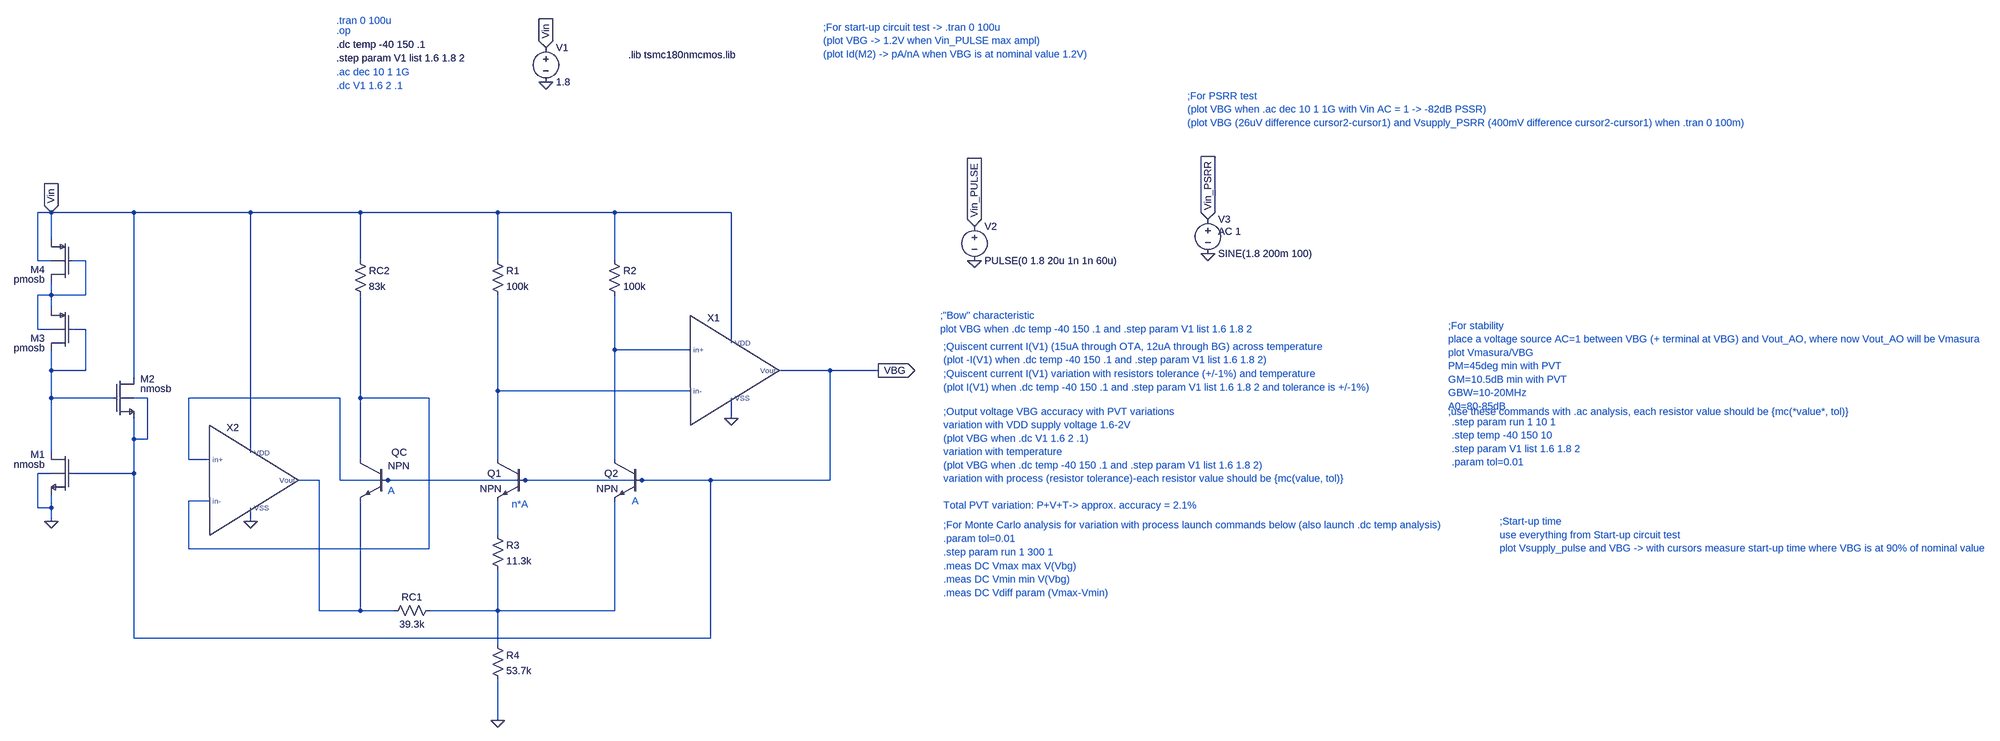
[diagram p0: schematic Brokaw_Bandgap.asc]
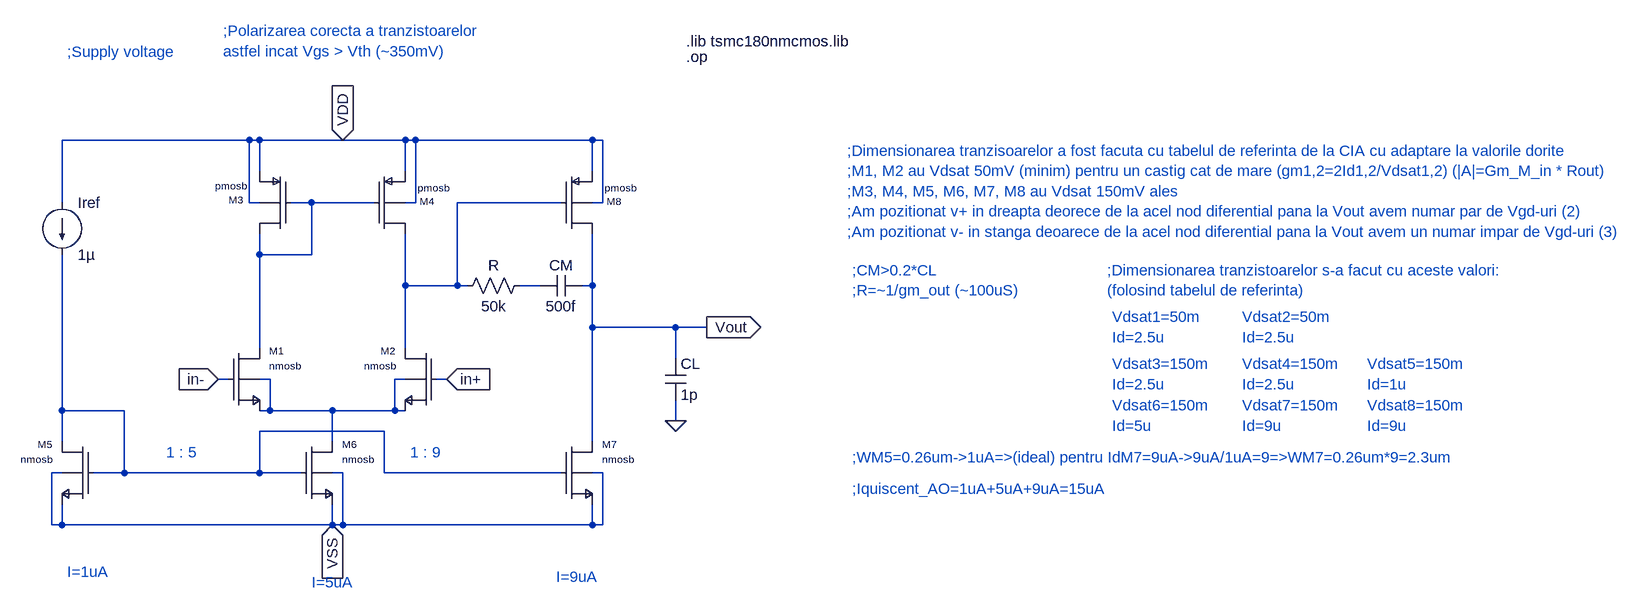
[diagram p1: sub-circuit ao_miller.asc]
Brokaw_Bandgap.asc, the LTspice schematic file:
Version 4
SHEET 1 3360 1700
WIRE -1312 -288 -1344 -288
WIRE -1120 -288 -1312 -288
WIRE -848 -288 -1120 -288
WIRE -592 -288 -848 -288
WIRE -272 -288 -592 -288
WIRE 0 -288 -272 -288
WIRE 272 -288 0 -288
WIRE -1312 -224 -1312 -288
WIRE -1344 -176 -1344 -288
WIRE -1312 -176 -1344 -176
WIRE -1232 -176 -1264 -176
WIRE -592 -176 -592 -288
WIRE -272 -176 -272 -288
WIRE 0 -176 0 -288
WIRE -1312 -96 -1312 -128
WIRE -1312 -96 -1344 -96
WIRE -1232 -96 -1232 -176
WIRE -1232 -96 -1312 -96
WIRE -1312 -64 -1312 -96
WIRE -1344 -16 -1344 -96
WIRE -1312 -16 -1344 -16
WIRE -1232 -16 -1264 -16
WIRE 272 16 272 -288
WIRE 0 32 0 -96
WIRE 176 32 0 32
WIRE -1312 80 -1312 32
WIRE -1232 80 -1232 -16
WIRE -1232 80 -1312 80
WIRE 544 80 384 80
WIRE 656 80 544 80
WIRE -1120 96 -1120 -288
WIRE -272 128 -272 -96
WIRE 176 128 -272 128
WIRE -1312 144 -1312 80
WIRE -1168 144 -1312 144
WIRE -1088 144 -1120 144
WIRE -640 144 -992 144
WIRE -592 144 -592 -96
WIRE -432 144 -592 144
WIRE 272 192 272 144
WIRE -1120 240 -1120 192
WIRE -1088 240 -1088 144
WIRE -1088 240 -1120 240
WIRE -1312 272 -1312 144
WIRE -848 272 -848 -288
WIRE -992 288 -992 144
WIRE -944 288 -992 288
WIRE -592 288 -592 144
WIRE -272 288 -272 128
WIRE 0 288 0 32
WIRE -1312 320 -1344 320
WIRE -1120 320 -1120 240
WIRE -1120 320 -1264 320
WIRE -688 336 -736 336
WIRE -640 336 -640 144
WIRE -528 336 -640 336
WIRE -208 336 -528 336
WIRE 64 336 -208 336
WIRE 224 336 64 336
WIRE 544 336 544 80
WIRE 544 336 224 336
WIRE -944 384 -992 384
WIRE -1344 400 -1344 320
WIRE -1312 400 -1312 368
WIRE -1312 400 -1344 400
WIRE -1312 432 -1312 400
WIRE -848 432 -848 400
WIRE -272 464 -272 384
WIRE -992 496 -992 384
WIRE -432 496 -432 144
WIRE -432 496 -992 496
WIRE -688 640 -688 336
WIRE -592 640 -592 384
WIRE -592 640 -688 640
WIRE -512 640 -592 640
WIRE -272 640 -272 544
WIRE -272 640 -432 640
WIRE 0 640 0 384
WIRE 0 640 -272 640
WIRE -1120 704 -1120 320
WIRE 224 704 224 336
WIRE 224 704 -1120 704
WIRE -272 720 -272 640
WIRE -272 896 -272 800
FLAG -160 -592 0
FLAG -160 -672 Vin
IOPIN -160 -672 In
FLAG 656 80 VBG
IOPIN 656 80 Out
FLAG 272 192 0
FLAG -1312 432 0
FLAG 880 -176 0
FLAG 880 -256 Vin_PULSE
IOPIN 880 -256 In
FLAG 1424 -192 0
FLAG 1424 -272 Vin_PSRR
IOPIN 1424 -272 In
FLAG -272 896 0
FLAG -848 432 0
FLAG -1312 -288 Vin
IOPIN -1312 -288 In
SYMBOL AO_Miller 288 48 R0
WINDOW 0 -57 -75 Bottom 2
SYMATTR InstName X1
SYMBOL voltage -160 -688 R0
WINDOW 123 24 44 Left 2
WINDOW 39 0 0 Left 0
SYMATTR InstName V1
SYMATTR Value 1.8
SYMBOL res -288 -192 R0
SYMATTR InstName R1
SYMATTR Value 100k
SYMATTR SpiceLine tol=0
SYMBOL res -16 -192 R0
SYMATTR InstName R2
SYMATTR Value 100k
SYMATTR SpiceLine tol=0
SYMBOL res -288 448 R0
SYMATTR InstName R3
SYMATTR Value 11.3k
SYMATTR SpiceLine tol=0
SYMBOL npn -208 288 M0
SYMATTR InstName Q1
SYMATTR SpiceLine AREA=8
SYMBOL npn 64 288 M0
SYMATTR InstName Q2
SYMATTR SpiceLine AREA=1
SYMBOL pmosb -1264 -224 M0
WINDOW 0 63 69 Left 2
WINDOW 3 63 92 Left 2
SYMATTR InstName M4
SYMATTR Value2 l=100u w=0.88u
SYMBOL pmosb -1264 -64 M0
WINDOW 0 63 69 Left 2
WINDOW 3 63 92 Left 2
SYMATTR InstName M3
SYMATTR Value2 l=100u w=0.88u
SYMBOL nmosb -1168 96 R0
WINDOW 0 63 4 Left 2
WINDOW 3 63 27 Left 2
SYMATTR InstName M2
SYMATTR Value2 l=10u w=3.84u
SYMBOL nmosb -1264 272 M0
WINDOW 0 63 4 Left 2
WINDOW 3 63 27 Left 2
SYMATTR InstName M1
SYMATTR Value2 l=5u w=0.5u
SYMBOL voltage 880 -272 R0
WINDOW 123 0 0 Left 0
WINDOW 39 0 0 Left 0
SYMATTR InstName V2
SYMATTR Value PULSE(0 1.8 20u 1n 1n 60u)
SYMBOL voltage 1424 -288 R0
WINDOW 123 24 44 Left 2
WINDOW 39 0 0 Left 0
SYMATTR Value2 AC 1
SYMATTR InstName V3
SYMATTR Value SINE(1.8 200m 100)
SYMBOL res -288 704 R0
SYMATTR InstName R4
SYMATTR Value 53.7k
SYMBOL res -608 -192 R0
SYMATTR InstName RC2
SYMATTR Value 83k
SYMBOL npn -528 288 M0
WINDOW 0 -44 -17 Left 2
WINDOW 3 -50 15 Left 2
SYMATTR InstName QC
SYMATTR SpiceLine AREA=1
SYMBOL res -416 624 R90
WINDOW 0 0 56 VBottom 2
WINDOW 3 32 56 VTop 2
SYMATTR InstName RC1
SYMATTR Value 39.3k
SYMBOL AO_Miller -832 304 R0
WINDOW 0 -57 -75 Bottom 2
SYMATTR InstName X2
TEXT -240 392 Left 2 ;n*A
TEXT 40 384 Left 2 ;A
TEXT -648 -712 Left 2 ;.op
TEXT -648 -680 Left 2 !.dc temp -40 150 .1
TEXT 32 -656 Left 2 !.lib tsmc180nmcmos.lib
TEXT -648 -736 Left 2 ;.tran 0 100u
TEXT 528 -720 Left 2 ;;For start-up circuit test -> .tran 0 100u\n(plot VBG -> 1.2V when Vin_PULSE max ampl)\n(plot Id(M2) -> pA/nA when VBG is at nominal value 1.2V)
TEXT -648 -648 Left 2 !.step param V1 list 1.6 1.8 2
TEXT -648 -616 Left 2 ;.ac dec 10 1 1G
TEXT 1376 -560 Left 2 ;;For PSRR test\n(plot VBG when .ac dec 10 1 1G with Vin AC = 1 -> -82dB PSSR)\n(plot VBG (26uV difference cursor2-cursor1) and Vsupply_PSRR (400mV difference cursor2-cursor1) when .tran 0 100m)
TEXT 808 24 Left 2 ;;Quiscent current I(V1) (15uA through OTA, 12uA through BG) across temperature\n(plot -I(V1) when .dc temp -40 150 .1 and .step param V1 list 1.6 1.8 2)
TEXT -648 -584 Left 2 ;.dc V1 1.6 2 .1
TEXT 808 88 Left 2 ;;Quiscent current I(V1) variation with resistors tolerance (+/-1%) and temperature\n(plot I(V1) when .dc temp -40 150 .1 and .step param V1 list 1.6 1.8 2 and tolerance is +/-1%)
TEXT 808 176 Left 2 ;;Output voltage VBG accuracy with PVT variations\nvariation with VDD supply voltage 1.6-2V\n(plot VBG when .dc V1 1.6 2 .1)\nvariation with temperature\n(plot VBG when .dc temp -40 150 .1 and .step param V1 list 1.6 1.8 2)\nvariation with process (resistor tolerance)-each resistor value should be {mc(value, tol)}\n \nTotal PVT variation: P+V+T-> approx. accuracy = 2.1%
TEXT 808 472 Left 2 ;.param tol=0.01\n.step param run 1 300 1
TEXT 808 536 Left 2 ;.meas DC Vmax max V(Vbg)\n.meas DC Vmin min V(Vbg)\n.meas DC Vdiff param (Vmax-Vmin)
TEXT 808 440 Left 2 ;;For Monte Carlo analysis for variation with process launch commands below (also launch .dc temp analysis)
TEXT 800 -48 Left 2 ;;"Bow" characteristic\nplot VBG when .dc temp -40 150 .1 and .step param V1 list 1.6 1.8 2
TEXT 1984 -24 Left 2 ;;For stability\nplace a voltage source AC=1 between VBG (+ terminal at VBG) and Vout_AO, where now Vout_AO will be Vmasura\nplot Vmasura/VBG\nPM=45deg min with PVT\nGM=10.5dB min with PVT\nGBW=10-20MHz\nA0=80-85dB
TEXT 2104 432 Left 2 ;;Start-up time\nuse everything from Start-up circuit test\nplot Vsupply_pulse and VBG -> with cursors measure start-up time where VBG is at 90% of nominal value
TEXT 1992 200 Left 2 ;.step param run 1 10 1\n.step temp -40 150 10\n.step param V1 list 1.6 1.8 2\n.param tol=0.01
TEXT 1984 176 Left 2 ;;use these commands with .ac analysis, each resistor value should be {mc(*value*, tol)}
TEXT -528 360 Left 2 ;A

ao_miller.asc, the sub-circuit schematic file:
Version 4
SHEET 1 2312 680
WIRE 80 -304 -208 -304
WIRE 96 -304 80 -304
WIRE 224 -304 96 -304
WIRE 320 -304 224 -304
WIRE 336 -304 320 -304
WIRE 608 -304 336 -304
WIRE 624 -304 608 -304
WIRE 96 -256 96 -304
WIRE 320 -256 320 -304
WIRE 608 -256 608 -304
WIRE -208 -208 -208 -304
WIRE 80 -208 80 -304
WIRE 96 -208 80 -208
WIRE 176 -208 144 -208
WIRE 272 -208 176 -208
WIRE 336 -208 336 -304
WIRE 336 -208 320 -208
WIRE 560 -208 400 -208
WIRE 624 -208 624 -304
WIRE 624 -208 608 -208
WIRE 96 -128 96 -160
WIRE 176 -128 176 -208
WIRE 176 -128 96 -128
WIRE 320 -80 320 -160
WIRE 400 -80 400 -208
WIRE 400 -80 320 -80
WIRE 416 -80 400 -80
WIRE 528 -80 496 -80
WIRE 608 -80 608 -160
WIRE 608 -80 592 -80
WIRE 608 -16 608 -80
WIRE 736 -16 608 -16
WIRE 784 -16 736 -16
WIRE 96 16 96 -128
WIRE 320 16 320 -80
WIRE 736 32 736 -16
WIRE 48 64 32 64
WIRE 112 64 96 64
WIRE 320 64 304 64
WIRE 384 64 368 64
WIRE -208 112 -208 -128
WIRE -112 112 -208 112
WIRE 112 112 112 64
WIRE 112 112 96 112
WIRE 208 112 112 112
WIRE 304 112 304 64
WIRE 304 112 208 112
WIRE 320 112 304 112
WIRE 736 128 736 96
WIRE 288 144 96 144
WIRE -208 160 -208 112
WIRE 208 160 208 112
WIRE 608 160 608 -16
WIRE -208 208 -224 208
WIRE -112 208 -112 112
WIRE -112 208 -160 208
WIRE 96 208 96 144
WIRE 96 208 -112 208
WIRE 160 208 96 208
WIRE 224 208 208 208
WIRE 288 208 288 144
WIRE 560 208 288 208
WIRE 624 208 608 208
WIRE -224 288 -224 208
WIRE -208 288 -208 256
WIRE -208 288 -224 288
WIRE 208 288 208 256
WIRE 208 288 -208 288
WIRE 224 288 224 208
WIRE 224 288 208 288
WIRE 608 288 608 256
WIRE 608 288 224 288
WIRE 624 288 624 208
WIRE 624 288 608 288
FLAG 384 64 in+
IOPIN 384 64 In
FLAG 32 64 in-
IOPIN 32 64 In
FLAG 224 -304 VDD
IOPIN 224 -304 In
FLAG 784 -16 Vout
IOPIN 784 -16 Out
FLAG 208 288 VSS
IOPIN 208 288 In
FLAG 736 128 0
SYMBOL nmosb 48 16 R0
WINDOW 0 63 4 Left 1
WINDOW 3 63 27 Left 1
SYMATTR InstName M1
SYMATTR Value2 l=1u w=5.76u
SYMBOL nmosb 368 16 M0
WINDOW 0 63 4 Left 1
WINDOW 3 63 27 Left 1
SYMATTR InstName M2
SYMATTR Value2 l=1u w=5.76u
SYMBOL current -208 -208 R0
WINDOW 123 0 0 Left 0
WINDOW 39 0 0 Left 0
SYMATTR InstName Iref
SYMATTR Value 1µ
SYMBOL nmosb 160 160 R0
WINDOW 0 63 4 Left 1
WINDOW 3 63 27 Left 1
SYMATTR InstName M6
SYMATTR Value2 l=1u w=1.3u
SYMBOL nmosb -160 160 M0
WINDOW 0 63 4 Left 1
WINDOW 3 63 27 Left 1
SYMATTR InstName M5
SYMATTR Value2 l=1u w=0.26u
SYMBOL pmosb 144 -256 M0
WINDOW 0 73 44 Left 1
WINDOW 3 68 22 Left 1
SYMATTR InstName M3
SYMATTR Value2 l=1u w=2.19u
SYMBOL pmosb 272 -256 R0
WINDOW 0 70 46 Left 1
WINDOW 3 67 25 Left 1
SYMATTR InstName M4
SYMATTR Value2 l=1u w=2.19u
SYMBOL pmosb 560 -256 R0
WINDOW 0 70 46 Left 1
WINDOW 3 67 25 Left 1
SYMATTR InstName M8
SYMATTR Value2 l=1u w=7.89u
SYMBOL nmosb 560 160 R0
WINDOW 0 63 4 Left 1
WINDOW 3 63 27 Left 1
SYMATTR InstName M7
SYMATTR Value2 l=1u w=2.3u
SYMBOL cap 720 32 R0
SYMATTR InstName CL
SYMATTR Value 1p
SYMBOL res 512 -96 R90
WINDOW 0 0 56 VBottom 2
WINDOW 3 32 56 VTop 2
SYMATTR InstName R
SYMATTR Value 50k
SYMBOL cap 592 -96 R90
WINDOW 0 0 32 VBottom 2
WINDOW 3 32 32 VTop 2
SYMATTR InstName CM
SYMATTR Value 500f
TEXT 752 -456 Left 2 !.lib tsmc180nmcmos.lib
TEXT -48 176 Left 2 ;1 : 5
TEXT 1008 184 Left 2 ;;WM5=0.26um->1uA=>(ideal) pentru IdM7=9uA->9uA/1uA=9=>WM7=0.26um*9=2.3um
TEXT 1800 40 Left 2 ;Vdsat5=150m\nId=1u
TEXT -200 360 Left 2 ;I=1uA
TEXT 176 376 Left 2 ;I=5uA
TEXT 552 368 Left 2 ;I=9uA
TEXT 1008 232 Left 2 ;;Iquiscent_AO=1uA+5uA+9uA=15uA
TEXT 328 176 Left 2 ;1 : 9
TEXT 40 -472 Left 2 ;;Polarizarea corecta a tranzistoarelor\nastfel incat Vgs > Vth (~350mV)
TEXT 1408 -32 Left 2 ;Vdsat1=50m\nId=2.5u
TEXT 1608 -32 Left 2 ;Vdsat2=50m\nId=2.5u
TEXT 1408 40 Left 2 ;Vdsat3=150m\nId=2.5u
TEXT 1608 40 Left 2 ;Vdsat4=150m\nId=2.5u
TEXT 1800 104 Left 2 ;Vdsat8=150m\nId=9u
TEXT 1608 104 Left 2 ;Vdsat7=150m\nId=9u
TEXT 1408 104 Left 2 ;Vdsat6=150m\nId=5u
TEXT 1000 -288 Left 2 ;;Dimensionarea tranzisoarelor a fost facuta cu tabelul de referinta de la CIA cu adaptare la valorile dorite\n;M1, M2 au Vdsat 50mV (minim) pentru un castig cat de mare (gm1,2=2Id1,2/Vdsat1,2) (|A|=Gm_M_in * Rout)\n;M3, M4, M5, M6, M7, M8 au Vdsat 150mV ales\n;Am pozitionat v+ in dreapta deorece de la acel nod diferential pana la Vout avem numar par de Vgd-uri (2)\n;Am pozitionat v- in stanga deoarece de la acel nod diferential pana la Vout avem un numar impar de Vgd-uri (3)
TEXT -200 -440 Left 2 ;;Supply voltage
TEXT 1400 -104 Left 2 ;;Dimensionarea tranzistoarelor s-a facut cu aceste valori:\n(folosind tabelul de referinta)
TEXT 752 -432 Left 2 !.op
TEXT 1008 -104 Left 2 ;;CM>0.2*CL\n;R=~1/gm_out (~100uS)

The netlist it stands for:
* Brokaw_Bandgap.asc
XX1 N003 N004 Vin 0 VBG ao_miller
V1 Vin 0 1.8
R1 Vin N004 100k tol=0
R2 Vin N003 100k tol=0
R3 N007 N008 11.3k tol=0
Q1 N004 VBG N007 0 NPN AREA=8
Q2 N003 VBG N008 0 NPN AREA=1
M4 N001 N001 Vin Vin pmosb l=100u w=0.88u
M3 N002 N002 N001 N001 pmosb l=100u w=0.88u
M2 Vin N002 VBG VBG nmosb l=10u w=3.84u
M1 N002 VBG 0 0 nmosb l=5u w=0.5u
V2 Vin_PULSE 0 PULSE(0 1.8 20u 1n 1n 60u)
V3 Vin_PSRR 0 SINE(1.8 200m 100) AC 1
R4 N008 0 53.7k
RC2 Vin N005 83k
QC N005 VBG N006 0 NPN AREA=1
RC1 N008 N006 39.3k
XX2 VBG N005 Vin 0 N006 ao_miller

* block symbol definitions
.subckt ao_miller in+ in- VDD VSS Vout
M1 N001 in- N004 N004 nmosb l=1u w=5.76u
M2 N002 in+ N004 N004 nmosb l=1u w=5.76u
Iref VDD N005 1µ
M6 N004 N005 VSS VSS nmosb l=1u w=1.3u
M5 N005 N005 VSS VSS nmosb l=1u w=0.26u
M3 N001 N001 VDD VDD pmosb l=1u w=2.19u
M4 N002 N001 VDD VDD pmosb l=1u w=2.19u
M8 Vout N002 VDD VDD pmosb l=1u w=7.89u
M7 Vout N005 VSS VSS nmosb l=1u w=2.3u
CL Vout 0 1p
R N003 N002 50k
CM Vout N003 500f
.lib tsmc180nmcmos.lib
* 1 : 5
* ;WM5=0.26um->1uA=>(ideal) pentru IdM7=9uA->9uA/1uA=9=>WM7=0.26um*9=2.3um
* Vdsat5=150m
* Id=1u
* I=1uA
* I=5uA
* I=9uA
* ;Iquiscent_AO=1uA+5uA+9uA=15uA
* 1 : 9
* ;Polarizarea corecta a tranzistoarelor
* astfel incat Vgs > Vth (~350mV)
* Vdsat1=50m
* Id=2.5u
* Vdsat2=50m
* Id=2.5u
* Vdsat3=150m
* Id=2.5u
* Vdsat4=150m
* Id=2.5u
* Vdsat8=150m
* Id=9u
* Vdsat7=150m
* Id=9u
* Vdsat6=150m
* Id=5u
* ;Dimensionarea tranzisoarelor a fost facuta cu tabelul de referinta de la CIA cu adaptare la valorile dorite
* ;M1, M2 au Vdsat 50mV (minim) pentru un castig cat de mare (gm1,2=2Id1,2/Vdsat1,2) (|A|=Gm_M_in * Rout)
* ;M3, M4, M5, M6, M7, M8 au Vdsat 150mV ales
* ;Am pozitionat v+ in dreapta deorece de la acel nod diferential pana la Vout avem numar par de Vgd-uri (2)
* ;Am pozitionat v- in stanga deoarece de la acel nod diferential pana la Vout avem un numar impar de Vgd-uri (3)
* ;Supply voltage
* ;Dimensionarea tranzistoarelor s-a facut cu aceste valori:
* (folosind tabelul de referinta)
.op
* ;CM>0.2*CL
* ;R=~1/gm_out (~100uS)
.ends ao_miller

.model NPN NPN
.model PNP PNP
.lib standard.bjt
.model NMOS NMOS
.model PMOS PMOS
.lib standard.mos
* n*A
* A
* .op
.dc temp -40 150 .1
.lib tsmc180nmcmos.lib
* .tran 0 100u
* ;For start-up circuit test -> .tran 0 100u
* (plot VBG -> 1.2V when Vin_PULSE max ampl)
* (plot Id(M2) -> pA/nA when VBG is at nominal value 1.2V)
.step param V1 list 1.6 1.8 2
* .ac dec 10 1 1G
* ;For PSRR test
* (plot VBG when .ac dec 10 1 1G with Vin AC = 1 -> -82dB PSSR)
* (plot VBG (26uV difference cursor2-cursor1) and Vsupply_PSRR (400mV difference cursor2-cursor1) when .tran 0 100m)
* ;Quiscent current I(V1) (15uA through OTA, 12uA through BG) across temperature
* (plot -I(V1) when .dc temp -40 150 .1 and .step param V1 list 1.6 1.8 2)
* .dc V1 1.6 2 .1
* ;Quiscent current I(V1) variation with resistors tolerance (+/-1%) and temperature
* (plot I(V1) when .dc temp -40 150 .1 and .step param V1 list 1.6 1.8 2 and tolerance is +/-1%)
* ;Output voltage VBG accuracy with PVT variations
* variation with VDD supply voltage 1.6-2V
* (plot VBG when .dc V1 1.6 2 .1)
* variation with temperature
* (plot VBG when .dc temp -40 150 .1 and .step param V1 list 1.6 1.8 2)
* variation with process (resistor tolerance)-each resistor value should be {mc(value, tol)}
* Total PVT variation: P+V+T-> approx. accuracy = 2.1%
* .param tol=0.01
* .step param run 1 300 1
* .meas DC Vmax max V(Vbg)
* .meas DC Vmin min V(Vbg)
* .meas DC Vdiff param (Vmax-Vmin)
* ;For Monte Carlo analysis for variation with process launch commands below (also launch .dc temp analysis)
* ;"Bow" characteristic
* plot VBG when .dc temp -40 150 .1 and .step param V1 list 1.6 1.8 2
* ;For stability
* place a voltage source AC=1 between VBG (+ terminal at VBG) and Vout_AO, where now Vout_AO will be Vmasura
* plot Vmasura/VBG
* PM=45deg min with PVT
* GM=10.5dB min with PVT
* GBW=10-20MHz
* A0=80-85dB
* ;Start-up time
* use everything from Start-up circuit test
* plot Vsupply_pulse and VBG -> with cursors measure start-up time where VBG is at 90% of nominal value
* .step param run 1 10 1
* .step temp -40 150 10
* .step param V1 list 1.6 1.8 2
* .param tol=0.01
* ;use these commands with .ac analysis, each resistor value should be {mc(*value*, tol)}
* A
.backanno
.end